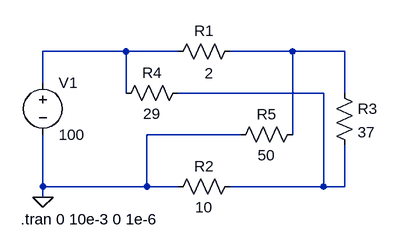
[diagram p0: schematic Einfaches_elektrisches_Netzwerk_3_6.asc]
Einfaches_elektrisches_Netzwerk_3_6.asc, the LTspice schematic file:
Version 4
SHEET 1 880 680
WIRE 32 64 -96 64
WIRE 112 64 32 64
WIRE 288 64 192 64
WIRE 368 64 288 64
WIRE -96 112 -96 64
WIRE 32 128 32 64
WIRE 336 128 112 128
WIRE 368 128 368 64
WIRE 208 192 64 192
WIRE 288 192 288 64
WIRE -96 272 -96 192
WIRE 64 272 64 192
WIRE 64 272 -96 272
WIRE 112 272 64 272
WIRE 336 272 336 128
WIRE 336 272 192 272
WIRE 368 272 368 208
WIRE 368 272 336 272
WIRE -96 288 -96 272
FLAG -96 288 0
SYMBOL res 208 48 R90
WINDOW 0 0 56 VBottom 2
WINDOW 3 34 48 VTop 2
SYMATTR InstName R1
SYMATTR Value 2
SYMBOL res 96 288 R270
WINDOW 0 32 56 VTop 2
WINDOW 3 0 56 VBottom 2
SYMATTR InstName R2
SYMATTR Value 10
SYMBOL res 352 112 R0
SYMATTR InstName R3
SYMATTR Value 37
SYMBOL res 128 112 R90
WINDOW 0 0 56 VBottom 2
WINDOW 3 32 56 VTop 2
SYMATTR InstName R4
SYMATTR Value 29
SYMBOL res 304 176 R90
WINDOW 0 0 56 VBottom 2
WINDOW 3 32 56 VTop 2
SYMATTR InstName R5
SYMATTR Value 50
SYMBOL voltage -96 96 R0
WINDOW 123 0 0 Left 2
WINDOW 39 0 0 Left 2
SYMATTR InstName V1
SYMATTR Value 100
TEXT -130 322 Left 2 !.tran 0 10e-3 0 1e-6

The netlist it stands for:
* Einfaches_elektrisches_Netzwerk_3_6.asc
R1 N002 N001 2
R2 0 N003 10
R3 N002 N003 37
R4 N003 N001 29
R5 N002 0 50
V1 N001 0 100
.tran 0 10e-3 0 1e-6
.backanno
.end